# Altium project pca20020.PrjPCB (part 2 of 2)

## Sheet pca20020_sheet7_sound_and_light.SchDoc: PCA20020 - Sound and Light
size A4; DocumentNumber: 7; Revision: 1.0.0; SheetNumber: 7; SheetTotal: 9; DrawnBy: RUBR; PCBRevision: 0264RUBR; DocumentSize: A4; PCAName: PCA20020; PCBNumber: 400182
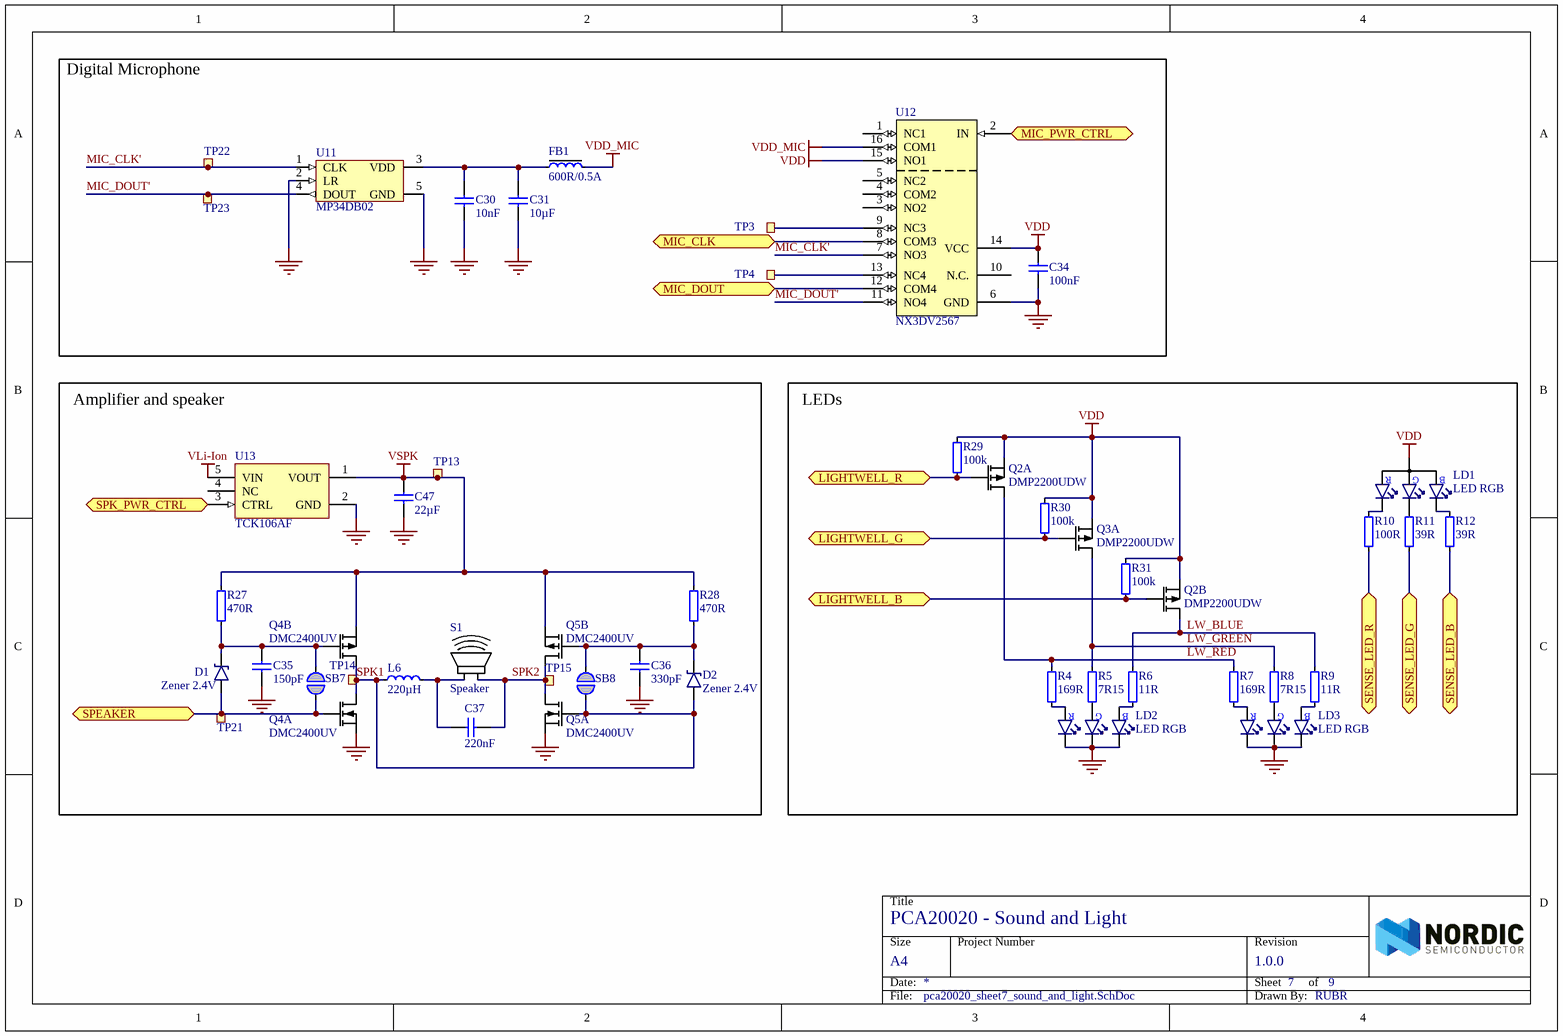
[diagram p6: pca20020_sheet7_sound_and_light.SchDoc]

### Parts
C30  10nF  [CAPC1005X04L]
C31  10µF  [CAPC1608X06L]
C34  100nF  [CAPC1005X04L]
C35  150pF  [CAPC1005X04L]
C36  330pF  [CAPC1005X04L]
C37  220nF  [CAPC1005X04L]
C47  22µF  [CAPC1608X06L]
D1  Zener 2.4V  [SOD-523]
D2  Zener 2.4V  [SOD-523]
FB1  600R/0.5A  [INDC1608X06L]
L6  220µH  [INDP4040X25N]
LD1  LED RGB  [LED_RGB_0606]
LD2  LED RGB  [MSL0104]
LD3  LED RGB  [MSL0104]
Q2  DMP2200UDW  [SOT-363]  (parts A,B of 2)
Q3  DMP2200UDW  [SOT-363]  (part A of 2)
Q4  DMC2400UV  [SOTFL50P162X60-6N]  (parts A,B of 2)
Q5  DMC2400UV  [SOTFL50P162X60-6N]  (parts A,B of 2)
R4  169R  [RESC1005X04L]
R5  7R15  [RESC1005X04L]
R6  11R  [RESC1005X04L]
R7  169R  [RESC1005X04L]
R8  7R15  [RESC1005X04L]
R9  11R  [RESC1005X04L]
R10  100R  [RESC1005X04L]
R11  39R  [RESC1005X04L]
R12  39R  [RESC1005X04L]
R27  470R  [RESC1005X04L]
R28  470R  [RESC1005X04L]
R29  100k  [RESC1005X04L]
R30  100k  [RESC1005X04L]
R31  100k  [RESC1005X04L]
S1  Speaker  [Speaker 15x11x3mm]  (no BOM)
SB7  Solderbridge  [Solderbridge]  (value not drawn)  (no BOM)
SB8  Solderbridge  [Solderbridge]  (value not drawn)  (no BOM)
TP3  TP  [TESTPAD-TH]  (value not drawn)  (no BOM)
TP4  TP  [TESTPAD-TH]  (value not drawn)  (no BOM)
TP13  Ø1.5mm,SMD  [TP_SMD_Ø1.5mm]  (value not drawn)  (no BOM)
TP14  Ø1.5mm,SMD  [TP_SMD_Ø1.5mm]  (value not drawn)  (no BOM)
TP15  Ø1.5mm,SMD  [TP_SMD_Ø1.5mm]  (value not drawn)  (no BOM)
TP21  Ø1.5mm,SMD  [TP_SMD_Ø1.5mm]  (value not drawn)  (no BOM)
TP22  Ø1.5mm,SMD  [TP_SMD_Ø1.5mm]  (value not drawn)  (no BOM)
TP23  Ø1.5mm,SMD  [TP_SMD_Ø1.5mm]  (value not drawn)  (no BOM)
U11  MP34DB02  [RHLGA-4 (3x4x1mm)]
U12  NX3DV2567  [XQFN40P180X260X50-16N]
U13  TCK106AF  [SOT95P280X140-5N]

### Blocks framed on the sheet
Digital Microphone: C30 C31 C34 FB1 TP3 TP4 TP22 TP23 U11 U12
Amplifier and speaker: C35-C37 C47 D1 D2 L6 Q4 Q5 R27 R28 S1 SB7 SB8 TP13-TP15 TP21 U13
LEDs: LD1-LD3 Q2 Q3 R4-R12 R29-R31

### Ports
LIGHTWELL_B (bidir), LIGHTWELL_G (bidir), LIGHTWELL_R (bidir), MIC_CLK (bidir), MIC_DOUT (bidir), MIC_PWR_CTRL (bidir), SENSE_LED_B (bidir), SENSE_LED_G (bidir), SENSE_LED_R (bidir), SPEAKER (bidir), SPK_PWR_CTRL (bidir)

### Nets
GND: C30.1 C31.1 C34.1 C35.1 C36.1 C47.1 LD2.3(C_GREEN) LD2.4(C_RED) LD2.5(C_BLUE) LD3.3(C_GREEN) LD3.4(C_RED) LD3.5(C_BLUE) Q4.1(S1) Q5.1(S1) U11.2(LR) U11.5(GND) U12.6(GND) U13.2(GND)
VDD: C34.2 LD1.4(A) Q2.1(S1) Q2.4(S2) Q3.1(S1) R29.1 R30.1 R31.1 U12.14(VCC) U12.15(NO1)
VDD_MIC: FB1.2 U12.16(COM1)
VLi-Ion: U13.5(VIN)
VSPK: C47.2 Q4.4(S2) Q5.4(S2) R27.1 R28.1 TP13.1 U13.1(VOUT)
LIGHTWELL_B: Q2.5(G2) R31.2 ; port LIGHTWELL_B
LIGHTWELL_G: Q3.2(G1) R30.2 ; port LIGHTWELL_G
LIGHTWELL_R: Q2.2(G1) R29.2 ; port LIGHTWELL_R
LW_BLUE: Q2.3(D2) R6.1 R9.1
LW_GREEN: Q3.6(D1) R5.1 R8.1
LW_RED: Q2.6(D1) R4.1 R7.1
MIC_CLK': TP22.1 U11.1(CLK) U12.7(NO3)
MIC_DOUT': TP23.1 U11.4(DOUT) U12.11(NO4)
MIC_PWR_CTRL: U12.2(IN) ; port MIC_PWR_CTRL
P0.25: U12.12(COM4) ; port MIC_DOUT
P0.26: U12.8(COM3) ; port MIC_CLK
P0.27: D1.1(A) Q4.2(G1) SB7.2 TP21.1 ; port SPEAKER
P0.29: U13.3(CTRL) ; port SPK_PWR_CTRL
SENSE_LED_B: R12.1 ; port SENSE_LED_B
SENSE_LED_G: R11.1 ; port SENSE_LED_G
SENSE_LED_R: R10.1 ; port SENSE_LED_R
SPK1: D2.1(A) L6.1 Q4.3(D2) Q4.6(D1) Q5.2(G1) SB8.2 TP14.1
SPK2: C37.1 Q5.3(D2) Q5.6(D1) S1.2 TP15.1
NetC30_2: C30.2 C31.2 FB1.1 U11.3(VDD)
NetC35_2: C35.2 D1.3(C) Q4.5(G2) R27.2 SB7.1
NetC36_2: C36.2 D2.3(C) Q5.5(G2) R28.2 SB8.1
NetC37_2: C37.2 L6.2 S1.1
NetLD1_1: LD1.1(C_RED) R10.2
NetLD1_2: LD1.2(C_GREEN) R11.2
NetLD1_3: LD1.3(C_BLUE) R12.2
NetLD2_1: LD2.1(A_RED) R4.2
NetLD2_2: LD2.2(A_GREEN) R5.2
NetLD2_6: LD2.6(A_BLUE) R6.2
NetLD3_1: LD3.1(A_RED) R7.2
NetLD3_2: LD3.2(A_GREEN) R8.2
NetLD3_6: LD3.6(A_BLUE) R9.2
NetTP3_1: TP3.1 U12.9(NC3)
NetTP4_1: TP4.1 U12.13(NC4)

Not connected (* = marked no-connect by the designer): U12 1(NC1) 3(NO2) 4(COM2) 5(NC2) 10(N.C.); U13 4(NC)

### Notes on the sheet
- Title
- Size
- Date:
- Project Number
- Sheet         of
- Revision
- File:
- Drawn By:
- (in symbol LTST-C19HE1WT) R; G; B
- (in symbol MSL0104RGBU1) R; G; B

### Library data of the parts
C30 = C0402-10n: Capacitor, X7R, ±10%; Part number IPS: 00000007784; Note: 16V; Artikkelnr Noca: 20039166; Artikkelnr Simpro: N.A.; Part Number: C0402-10n; Manufacturer: *; Manufacturer Part Number: *; Datasheet: *; LatestRevisionDate: 2009-11-23; Pin Count: 2; Publisher: Nordic Semiconductor; Published: 2009-05-08; Value: 10nF; Supplier: *; Supplier part number: *; 2nd source Supplier: *; 2nd source part number: *; Footprint Doc: 0402
C31 = C0603-10µ: Capacitor, X5R, ±20%; Part number IPS: 00000007785; Note: 6.3V; Artikkelnr Noca: 20039234; Artikkelnr Simpro: N.A.; Part Number: C0603-10µ; Manufacturer: *; Manufacturer Part Number: *; Datasheet: *; LatestRevisionDate: 2011-01-17; Pin Count: 2; Publisher: Nordic Semiconductor; Published: 2011-01-17; Value: 10µF; Supplier: *; Supplier part number: *; 2nd source Supplier: *; 2nd source part number: *; Footprint Doc: 0603
C34 = C0402-100n: Capacitor, X7R, ±10%; Part number IPS: 00000005296; Note: 16V; Artikkelnr Noca: 20039200; Artikkelnr Simpro: N.A.; Part Number: C0402-100n; Manufacturer: *; Manufacturer Part Number: *; Datasheet: *; Footprint Doc: 0402; LatestRevisionDate: 2009-11-23; Pin Count: 2; Publisher: Nordic Semiconductor; Published: 2009-05-08; Value: 100nF; Supplier: *; Supplier part number: *; 2nd source Supplier: *; 2nd source part number: *
C35 = C0402-150p: Capacitor, NP0, ±5%; Part number IPS: 00000007972; Note: 50V; Artikkelnr Noca: 20029111; Artikkelnr Simpro: N.A.; Part Number: C0402-150p; Manufacturer: *; Manufacturer Part Number: *; Datasheet: *; Footprint Doc: 0402; LatestRevisionDate: 2009-05-08; Pin Count: 2; Publisher: Nordic Semiconductor; Published: 2009-05-08; Value: 150pF; Supplier: *; Supplier part number: *; 2nd source Supplier: *; 2nd source part number: *
C36 = C0402-330p: Capacitor, NP0, ±5%; Part number IPS: 00000006576; Note: 50V; Artikkelnr Noca: N.A.; Part Number: C0402-330p; Manufacturer: *; Manufacturer Part Number: *; Datasheet: *; Footprint Doc: 0402; LatestRevisionDate: 2017-02-02; Pin Count: 2; Publisher: Nordic Semiconductor; Published: 2009-05-08; Value: 330pF; Supplier: *; Supplier part number: *; 2nd source Supplier: *; 2nd source part number: *; Artikkelnr Simpro: N.A.
C37 = C0402-220n: Capacitor, X7R, ±10%; Part number IPS: 00000006793; Note: 16V; Artikkelnr Noca: N.A.; Part Number: C0402-220n; Manufacturer: *; Manufacturer Part Number: *; Datasheet: *; Footprint Doc: 0402; LatestRevisionDate: 2009-05-08; Pin Count: 2; Publisher: Nordic Semiconductor; Published: 2009-05-08; Value: 220nF; Supplier: *; Supplier part number: *; 2nd source Supplier: *; 2nd source part number: *; Artikkelnr Simpro: N.A.
C47 = C0603-22µ-6.3V: CAP CER 22UF 6.3V 20% X5R 0603; Manufacturer: Samsung; Manufacturer Part Number: CL10A226MQ8NRNC; Part number IPS: 00000007787; Artikkelnr Noca: N.A.; Part Number: C0603-22µ-6.3V; Datasheet: http://www.samsungsem.com/kr/front/downloadcms.do?path=/kr/support/product-search/mlcc/__icsFiles/afieldfile/2014/11/05&fileName=S_CL10A226MQ8NRNC.pdf; Footprint Doc: 0603; LatestRevisionDate: 2015-04-10; Pin Count: 2; Publisher: Nordic Semiconductor; Published: 2015-04-10; Value: 22µF; Note: 6.3V; Supplier: Digi-Key; Supplier part number: 1276-1193-1-ND; 2nd source Supplier: *; 2nd source part number: *; Artikkelnr Simpro: N.A.
D1 D2 = BZT52C2V4T: Diode, Zener, 2.4V, 0.3W; Manufacturer: Diodes Incorporated; Part number IPS: 00000007974; Artikkelnr Noca: N.A.; Part Number: BZT52C2V4T; Manufacturer Part Number: BZT52C2V4T; Datasheet: http://www.diodes.com/_files/datasheets/ds30502.pdf; Footprint Doc: SOD-523; LatestRevisionDate: 2017-01-25; Publisher: Nordic Semiconductor; Published: 2017-01-25; Value: Zener 2.4V; Note: *; Supplier: Digi-Key; Supplier part number: BZT52C2V4T-7DICT-ND; 2nd source Supplier: *; 2nd source part number: *; Artikkelnr Simpro: N.A.; Pin Count: 2
FB1 = FB0603-600R@100MHz-500mA: Ferrite Bead, 600 Ohm @ 100MHz, 500mA, 380 mOhm Max; Manufacturer: Murata; Manufacturer Part Number: BLM18AG601SN1; 2nd source part number: 490-1014-1-ND; Part number IPS: 00000007789; Note: Chip EMIFIL Inductor Type Chip Ferrite Bead; Artikkelnr Noca: 37019100; Artikkelnr Simpro: N.A.; Part Number: FB0603-600R@100MHz-500mA; Datasheet: http://www.farnell.com/datasheets/356366.pdf; Footprint Doc: 0603; LatestRevisionDate: 2014-01-10; Pin Count: 2; Publisher: Nordic Semiconductor; Published: 2010-09-02; Value: 600R/0.5A; Supplier: Farnell; Supplier part number: 151-5679; 2nd source Supplier: Digi-Key; ComponentLink1Description: Datasheet; ComponentLink2Description: Supplier link
L6 = L4040-220µ: Inductor, ±20%, 200mA, 2.76 Ohm; Manufacturer: Bourns; Manufacturer Part Number: SRN4026-221M; Part number IPS: 00000007797; Note: -40°C ~ 125°C; Artikkelnr Noca: N:A; Artikkelnr Simpro: N.A.; Part Number: L4040-220µ; Datasheet: http://www.bourns.com/docs/Product-Datasheets/SRN4026.pdf; Footprint Doc: 4040; LatestRevisionDate: 2016-01-18; Pin Count: 2; Publisher: Nordic Semiconductor; Published: 2016-01-18; Value: 220µH; Supplier: Digi-Key; Supplier part number: SRN4026-221MCT-ND; 2nd source Supplier: *; 2nd source part number: *; ComponentLink1Description: Datasheet; ComponentLink2Description: Supplier link
LD1 = LTST-C19HE1WT: RGB LED 1.60 mm x 1.60 mm SMD; Manufacturer: Lite-On Inc; 2nd source part number: 859-LTST-C19HE1WT; Part number IPS: 00000007798; Artikkelnr Noca: N.A.; Part Number: LTST-C19HE1WT; Manufacturer Part Number: LTST-C19HE1WT; Datasheet: http://optoelectronics.liteon.com/upload/download/DS22-2008-0044/S_110_LTST-C19HE1WT.pdf; LatestRevisionDate: 2016-09-23; Pin Count: 4; Publisher: Nordic Semiconductor; Published: 2016-09-23; Value: LED RGB; Note: *; Supplier: Digi-Key; Supplier part number: 160-2162-1-ND; 2nd source Supplier: Mouser; Footprint Doc: LED_RGB_0606; Artikkelnr Simpro: N.A.
LD2 LD3 = MSL0104RGBU1: High brightness, side view RGB LED; Manufacturer: ROHM; 2nd source part number: 755-MSL0104RGBU1; Part number IPS: 00000007799; Artikkelnr Noca: N.A.; Part Number: MSL0104RGBU1; Manufacturer Part Number: MSL0104RGBU1; Datasheet: http://www.rohm.com/web/eu/datasheet/MSL0104RGBU; LatestRevisionDate: 2016-09-21; Pin Count: 7; Publisher: Nordic Semiconductor; Published: 2016-09-21; Value: LED RGB; Note: *; Supplier: Digi-Key; Supplier part number: MSL0104RGBU1CT-ND; 2nd source Supplier: Mouser; Footprint Doc: 6922; Artikkelnr Simpro: N.A.
Q2 Q3 = DMP2200UDW: Dual P Ch MOFET, 900mA, 260mOhm, 450mW; Manufacturer: Diodes Incorporated; Part number IPS: 00000007802; Note: Dual P Channel Digital FET; Artikkelnr Noca: N.A.; Part Number: DMP2200UDW; Manufacturer Part Number: DMP2200UDW; Datasheet: http://www.diodes.com/_files/datasheets/DMP2200UDW.pdf; Footprint Doc: SOT-363; LatestRevisionDate: 2016-11-08; Pin Count: 6; Publisher: Nordic Semiconductor; Published: 2016-11-08; Value: DMP2200UDW; Supplier: Digi-Key; Supplier part number: DMP2200UDW-7DICT-ND; 2nd source Supplier: *; 2nd source part number: *; Artikkelnr Simpro: N.A.
Q4 Q5 = DMC2400UV: Dual N & P Ch MOFET, 1.03A/0.7A, 480mOhm, 450mW; Manufacturer: Diodes Incorporated; Part number IPS: 00000007803; Note: Dual N & P Channel Digital FET; Artikkelnr Noca: N.A.; Part Number: DMC2400UV; Manufacturer Part Number: DMC2400UV; Datasheet: http://www.diodes.com/_files/datasheets/DMC2400UV.pdf; Footprint Doc: SOT-563; LatestRevisionDate: 2016-01-18; Pin Count: 6; Publisher: Nordic Semiconductor; Published: 2016-01-18; Value: DMC2400UV; Supplier: Digi-Key; Supplier part number: DMC2400UV-7DICT-ND; 2nd source Supplier: *; 2nd source part number: *; Artikkelnr Simpro: N.A.
R4 R7 = R0402-169: Resistor, ±1%, 0.063W; Part number IPS: 00000007805; Note: Chip Res 1%; Artikkelnr Noca: N.A.; Value Ohm: 169; Part Number: R0402-169; Manufacturer: *; Manufacturer Part Number: *; Datasheet: *; LatestRevisionDate: 2016-09-22; Pin Count: 2; Publisher: Nordic Semiconductor; Published: 2016-09-22; Value: 169R; Supplier: Digi-Key; Supplier part number: 541-169LCT-ND; 2nd source Supplier: *; 2nd source part number: *; Footprint Doc: 0402; Artikkelnr Simpro: N.A.
R5 R8 = R0402-7R15: Resistor, ±1%, 0.063W; Part number IPS: 00000007806; Note: Chip Res 1%; Artikkelnr Noca: N.A.; Value Ohm: 7.15; Part Number: R0402-7R15; Manufacturer: *; Manufacturer Part Number: *; Datasheet: *; LatestRevisionDate: 2016-09-22; Pin Count: 2; Publisher: Nordic Semiconductor; Published: 2016-09-22; Value: 7R15; Supplier: Digi-Key; Supplier part number: 541-7.15LLCT-ND; 2nd source Supplier: *; 2nd source part number: *; Footprint Doc: 0402; Artikkelnr Simpro: N.A.
R6 R9 = R0402-11R: Resistor, ±1%, 0.063W; Part number IPS: 00000007807; Note: Chip Res 1%; Artikkelnr Noca: N.A.; Value Ohm: 11; Part Number: R0402-11R; Manufacturer: *; Manufacturer Part Number: *; Datasheet: *; LatestRevisionDate: 2016-11-09; Pin Count: 2; Publisher: Nordic Semiconductor; Published: 2016-11-09; Value: 11R; Supplier: Farnell; Supplier part number: 214-0577; 2nd source Supplier: *; 2nd source part number: *; Footprint Doc: 0402; Artikkelnr Simpro: N.A.
R10 = R0402-100: Resistor, ±1%, 0.063W; Part number IPS: 00000002811; Note: Chip Res 1%; Artikkelnr Noca: 27049049; Artikkelnr Simpro: N.A.; Value Ohm: 100; Part Number: R0402-100; Manufacturer: *; Manufacturer Part Number: *; Datasheet: *; LatestRevisionDate: 2009-11-23; Pin Count: 2; Publisher: Nordic Semiconductor; Published: 2009-05-08; Value: 100R; Supplier: Farnell; Supplier part number: 173-8837; 2nd source Supplier: *; 2nd source part number: *; Footprint Doc: 0402
R11 R12 = R0402-39R: Resistor, ±1%, 0.063W; Part number IPS: 00000000821; Note: Chip Res 1%; Artikkelnr Noca: 27049039; Artikkelnr Simpro: N.A.; Value Ohm: 39; Part Number: R0402-39R; Manufacturer: *; Manufacturer Part Number: *; Datasheet: *; LatestRevisionDate: 2009-11-23; Pin Count: 2; Publisher: Nordic Semiconductor; Published: 2009-05-08; Value: 39R; Supplier: Farnell; Supplier part number: 173-8831; 2nd source Supplier: *; 2nd source part number: *; Footprint Doc: 0402
R27 R28 = R0402-470: Resistor, ±1%, 0.063W; Part number IPS: 00000007975; Note: Chip Res 1%; Artikkelnr Noca: 27049065; Artikkelnr Simpro: N.A.; Value Ohm: 470; Part Number: R0402-470; Manufacturer: *; Manufacturer Part Number: *; Datasheet: *; LatestRevisionDate: 2009-11-23; Pin Count: 2; Publisher: Nordic Semiconductor; Published: 2009-05-08; Value: 470R; Supplier: Farnell; Supplier part number: 173-8845; 2nd source Supplier: *; 2nd source part number: *; Footprint Doc: 0402
R29-R31 = R0402-100k: Resistor, ±1%, 0.063W; Part number IPS: 00000003667; Note: Chip Res 1%; Artikkelnr Noca: 27049121; Artikkelnr Simpro: N.A.; Value Ohm: 100000; Part Number: R0402-100k; Manufacturer: *; Manufacturer Part Number: *; Datasheet: *; LatestRevisionDate: 2009-11-23; Pin Count: 2; Publisher: Nordic Semiconductor; Published: 2009-05-08; Value: 100k; Supplier: Farnell; Supplier part number: 173-8877; 2nd source Supplier: *; 2nd source part number: *; Footprint Doc: 0402
S1 = BMS1511F-11C-08H03P LF: Speaker, SMD, 15.0mm x 11.0mm x 3.0mm, 0Hz-20kHz, 89dB, 8 ohm, 0.7W; Manufacturer: BeStar; Artikkelnr Noca: N.A.; Part Number: BMS1511F-11C-08H03P LF; Manufacturer Part Number: BMS1511F-11C-08H03P LF; Datasheet: \\hizz\pro\app9717\Datasheet\speakers\bestar\BMS1511F-11C-08H03P LF.pdf; Footprint Doc: Speaker 15x11x3mm; LatestRevisionDate: 2016-09-15; Pin Count: 2; Publisher: Nordic Semiconductor; Published: 2016-09-15; Value: Speaker; Note: *; Supplier: *; Supplier part number: *; 2nd source Supplier: *; 2nd source part number: *; Artikkelnr Simpro: N.A.
SB7 SB8 = Solderbridge: Artikkelnr Noca: N.A.; Part Number: Solderbridge; Manufacturer: *; Manufacturer Part Number: *; Datasheet: *; Footprint Doc: Solderbridge; LatestRevisionDate: 2009-12-14; Pin Count: 2; Publisher: Nordic Semiconductor; Published: 2009-12-14; Value: Solderbridge; Note: *; Supplier: *; Supplier part number: *; 2nd source Supplier: *; 2nd source part number: *; Artikkelnr Simpro: N.A.
TP3 TP4 = Testpoint TH: Testpoint, through hole; Artikkelnr Noca: N.A.; Part Number: Testpoint TH; Manufacturer: *; Manufacturer Part Number: *; Datasheet: *; Footprint Doc: TESTPAD-TH; LatestRevisionDate: 2009-12-12; Pin Count: 1; Publisher: Nordic Semiconductor; Published: 2009-12-12; Value: TP; Note: *; Supplier: *; Supplier part number: *; 2nd source Supplier: *; 2nd source part number: *; Artikkelnr Simpro: N.A.
TP13-TP15 TP21-TP23 = TP_SMD_Ø1.5MM: 1.0mm circular SMD testpad; Manufacturer: Nordic Semiconductor; Artikkelnr Noca: N.A.; Part Number: TP_SMD_Ø1.5MM; Manufacturer Part Number: *; Datasheet: *; Footprint Doc: TP_SMD_Ø1.5mm; LatestRevisionDate: 2016-06-02; Pin Count: 1; Publisher: Nordic Semiconductor; Published: 2016-06-02; Value: Ø1.5mm,SMD; Note: *; Supplier: *; Supplier part number: *; 2nd source Supplier: *; 2nd source part number: *; Artikkelnr Simpro: N.A.
U11 = MP34DB02: MEMS audio sensor omnidirectional digital microphone; Manufacturer: STMicroelectronics; 2nd source part number: 511-MP34DB02TR; Part number IPS: 00000007822; Note: Alternative: ADMP421, SPK0833LM4H-B, MP34DB01; Artikkelnr Noca: N.A.; Part Number: MP34DB02; Manufacturer Part Number: MP34DB02; Datasheet: http://www.st.com/web/en/resource/technical/document/datasheet/DM00111225.pdf; LatestRevisionDate: 2015-11-11; Pin Count: 5; Publisher: Nordic Semiconductor; Published: 2015-11-11; Value: MP34DB02; Supplier: Digi-Key; Supplier part number: 497-15103-1-ND; 2nd source Supplier: Mouser; Footprint Doc: RHLGA-4; Artikkelnr Simpro: N.A.
U12 = NX3DV2567GU: Low-ohmic four-pole double-throw analog switch; Manufacturer: NXP Semiconductors; 2nd source part number: 771-NX3DV2567GU115; Part number IPS: 00000007816; Artikkelnr Noca: 15079317; Artikkelnr Simpro: N.A.; Part Number: NX3DV2567GU; Manufacturer Part Number: NX3DV2567GU; Datasheet: http://www.nxp.com/documents/data_sheet/NX3DV2567.pdf; Footprint Doc: XQFN-16; LatestRevisionDate: 2015-02-17; Pin Count: 16; Publisher: Nordic Semiconductor; Published: 2015-02-17; Value: NX3DV2567; Note: *; Supplier: Digi-Key; Supplier part number: 568-5206-1-ND; 2nd source Supplier: Mouser
U13 = TCK106AF,LF: 1.0 A Load Switch IC with Slew Rate Control Driver in Small Package; Manufacturer: Toshiba; Part number IPS: 00000007823; Artikkelnr Noca: 15070086; Artikkelnr Simpro: N.A.; Part Number: TCK106AF,LF; Manufacturer Part Number: TCK106AF,LF; Datasheet: https://toshiba.semicon-storage.com/info/docget.jsp?did=53240&prodName=TCK108AF; Footprint Doc: SOT-25; LatestRevisionDate: 2016-09-29; Pin Count: 5; Publisher: Nordic Semiconductor; Published: 2016-09-29; Value: TCK106AF; Note: *; Supplier: Digi-Key; Supplier part number: TCK106AFLFCT-ND; 2nd source Supplier: *; 2nd source part number: *

## Sheet pca20020_sheet8_power_supply.SchDoc: PCA20020 - Power Supply
size A4; DocumentNumber: 8; Revision: 1.0.0; SheetNumber: 8; SheetTotal: 9; DrawnBy: RUBR; PCBRevision: 0264RUBR; DocumentSize: A4; PCAName: PCA20020; PCBNumber: 400182
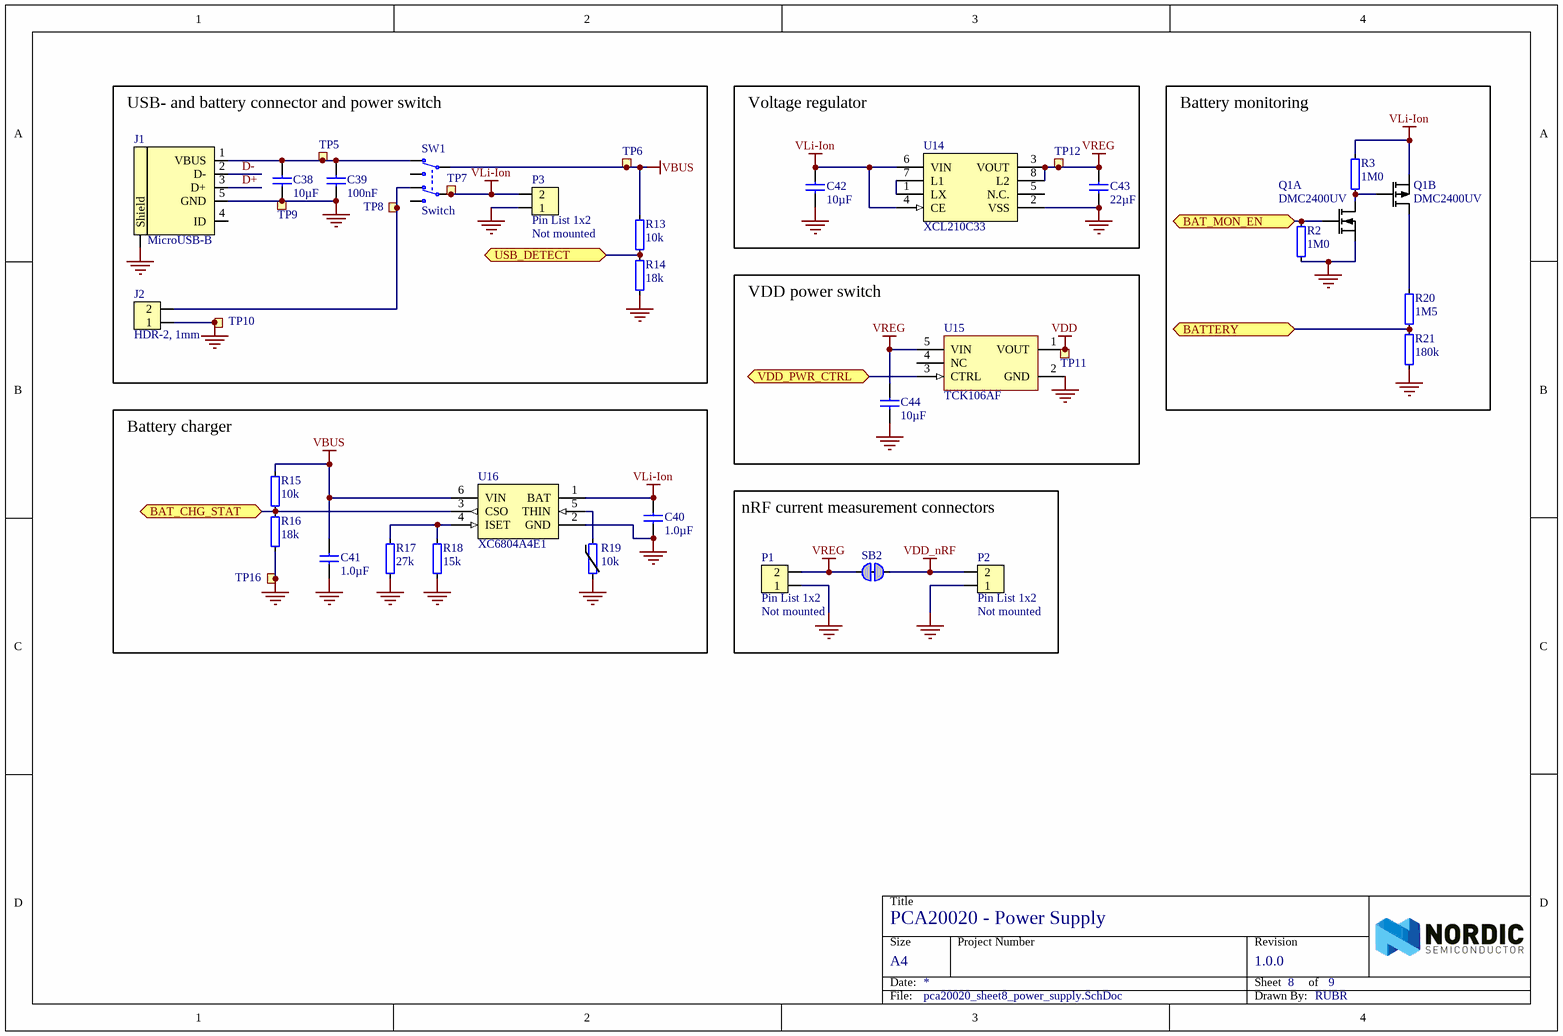
[diagram p7: pca20020_sheet8_power_supply.SchDoc]

### Parts
C38  10µF  [CAPC1608X06L]
C39  100nF  [CAPC1005X04L]
C40  1.0µF  [CAPC1608X06L]
C41  1.0µF  [CAPC1608X06L]
C42  10µF  [CAPC1608X06L]
C43  22µF  [CAPC1608X06L]
C44  10µF  [CAPC1608X06L]
J1  MicroUSB-B  [USB-Micro-B-RA-SMD-PiP]
J2  HDR-2, 1mm  [SM02B-SRSS-TB]
P1  Pin List 1x2  Assembly: Not mounted  [LIST_1x2-NC]
P2  Pin List 1x2  Assembly: Not mounted  [LIST_1x2-NC]
P3  Pin List 1x2  Assembly: Not mounted  [LIST_1x2-NC]
Q1  DMC2400UV  [SOTFL50P162X60-6N]  (parts A,B of 2)
R2  1M0  [RESC1005X04L]
R3  1M0  [RESC1005X04L]
R13  10k  [RESC1005X04L]
R14  18k  [RESC1005X04L]
R15  10k  [RESC1005X04L]
R16  18k  [RESC1005X04L]
R17  27k  [RESC1005X04L]
R18  15k  [RESC1005X04L]
R19  10k  [RESC1005X04L]
R20  1M5  [RESC1005X04L]
R21  180k  [RESC1005X04L]
SB2  Solderbridge  [Solderbridge_Shorted]  (value not drawn)  (net tie, no BOM)
SW1  Switch  [Switch-Slide-RA-J-Lead-DPDT-8.5x3.5mm]
TP5  Ø1.5mm,SMD  [TP_SMD_Ø1.5mm]  (value not drawn)  (no BOM)
TP6  Ø1.5mm,SMD  [TP_SMD_Ø1.5mm]  (value not drawn)  (no BOM)
TP7  Ø1.5mm,SMD  [TP_SMD_Ø1.5mm]  (value not drawn)  (no BOM)
TP8  Ø1.5mm,SMD  [TP_SMD_Ø1.5mm]  (value not drawn)  (no BOM)
TP9  Ø1.5mm,SMD  [TP_SMD_Ø1.5mm]  (value not drawn)  (no BOM)
TP10  Ø1.5mm,SMD  [TP_SMD_Ø1.5mm]  (value not drawn)  (no BOM)
TP11  Ø1.5mm,SMD  [TP_SMD_Ø1.5mm]  (value not drawn)  (no BOM)
TP12  Ø1.5mm,SMD  [TP_SMD_Ø1.5mm]  (value not drawn)  (no BOM)
TP16  TP  [TESTPAD-TH]  (value not drawn)  (no BOM)
U14  XCL210C33  [CL-2025]
U15  TCK106AF  [SOT95P280X140-5N]
U16  XC6804A4E1  [USP-6EL]

### Blocks framed on the sheet
USB- and battery connector and power switch: C38 C39 J1 J2 P3 R13 R14 SW1 TP5-TP10
Voltage regulator: C42 C43 TP12 U14
Battery monitoring: Q1 R2 R3 R20 R21
VDD power switch: C44 TP11 U15
Battery charger: C40 C41 R15-R19 TP16 U16
nRF current measurement connectors: P1 P2 SB2

### Ports
BAT_CHG_STAT (bidir), BAT_MON_EN (bidir), BATTERY (bidir), USB_DETECT (bidir), VDD_PWR_CTRL (bidir)

### Nets
GND: C38.2 C39.2 C40.1 C41.1 C42.1 C43.1 C44.1 J1.5(GND) J1.6(Shield) J2.1 P1.1 P2.1 P3.1 Q1.1(S1) R2.2 R14.2 R16.2 R17.2 R18.2 R19.2 R21.2 TP9.1 TP10.1 TP16.1 U14.2(VSS) U14.9(VSS) U15.2(GND) U16.2(GND) U16.7(GND)
VBUS: C41.2 R13.1 R15.1 SW1.2(COM-1) TP6.1 U16.6(VIN)
VDD: TP11.1 U15.1(VOUT)
VDD_nRF: P2.2 SB2.1
VLi-Ion: C40.2 C42.2 P3.2 Q1.4(S2) R3.1 SW1.5(COM-2) TP7.1 U14.4(CE) U14.6(VIN) U16.1(BAT)
VREG: C43.2 C44.2 P1.2 SB2.2 TP12.1 U14.3(VOUT) U14.8(L2) U15.5(VIN)
BAT_MON_EN: Q1.2(G1) R2.1 ; port BAT_MON_EN
D+: J1.3(D+)
D-: J1.2(D-)
P0.13: R13.2 R14.1 ; port USB_DETECT
P0.17: R15.2 R16.1 U16.3(CSO) ; port BAT_CHG_STAT
P0.28: R20.2 R21.1 ; port BATTERY
P0.30: U15.3(CTRL) ; port VDD_PWR_CTRL
NetC38_1: C38.1 C39.1 J1.1(VBUS) SW1.3(N.C-1) TP5.1
NetJ2_2: J2.2 SW1.6(N.C-2) TP8.1
NetQ1_3: Q1.3(D2) R20.1
NetQ1_5: Q1.5(G2) Q1.6(D1) R3.2
NetR17_1: R17.1 R18.1 U16.4(ISET)
NetR19_1: R19.1 U16.5(THIN)
NetU14_1: U14.1(LX) U14.7(L1)

Not connected (* = marked no-connect by the designer): J1 4(ID); SW1 1(N.O-1) 4(N.O-2); U14 5(N.C.); U15 4(NC)

### Notes on the sheet
- Title
- Size
- Date:
- Project Number
- Sheet         of
- Revision
- File:
- Drawn By:

### Library data of the parts
C38 C42 C44 = C0603-10µ: as C31 on sheet pca20020_sheet7_sound_and_light; Part Number: C0603-10µ; Manufacturer: *; Manufacturer Part Number: *; Datasheet: *; LatestRevisionDate: 2011-01-17; Pin Count: 2; Publisher: Nordic Semiconductor; Published: 2011-01-17; Value: 10µF; Supplier: *; Supplier part number: *; 2nd source Supplier: *; 2nd source part number: *; Footprint Doc: 0603
C39 = C0402-100n: as C34 on sheet pca20020_sheet7_sound_and_light; Part Number: C0402-100n; Manufacturer: *; Manufacturer Part Number: *; Datasheet: *; LatestRevisionDate: 2009-11-23; Pin Count: 2; Publisher: Nordic Semiconductor; Published: 2009-05-08; Value: 100nF; Supplier: *; Supplier part number: *; 2nd source Supplier: *; 2nd source part number: *; Footprint Doc: 0402
C40 C41 = C0603-1µ0: Capacitor, X7R, ±10%; Part number IPS: 00000000616; Note: 16V; Artikkelnr Noca: 20039335; Artikkelnr Simpro: N.A.; Part Number: C0603-1µ0; Manufacturer: *; Manufacturer Part Number: *; Datasheet: *; Footprint Doc: 0603; LatestRevisionDate: 2013-06-05; Pin Count: 2; Publisher: Nordic Semiconductor; Published: 2009-05-08; Value: 1.0µF; Supplier: *; Supplier part number: *; 2nd source Supplier: *; 2nd source part number: *
C43 = C0603-22µ-6.3V: as C47 on sheet pca20020_sheet7_sound_and_light; Part Number: C0603-22µ-6.3V; Datasheet: http://www.samsungsem.com/kr/front/downloadcms.do?path=/kr/support/product-search/mlcc/__icsFiles/afieldfile/2014/11/05&fileName=S_CL10A226MQ8NRNC.pdf; Footprint Doc: 0603; LatestRevisionDate: 2015-04-10; Pin Count: 2; Publisher: Nordic Semiconductor; Published: 2015-04-10; Value: 22µF; Note: 6.3V; Supplier: Digi-Key; Supplier part number: 1276-1193-1-ND; 2nd source Supplier: *; 2nd source part number: *; Artikkelnr Simpro: N.A.
J1 = USB-Micro-B-RA-SMD-PiP: MicroUSB-B-SMT; Manufacturer: Allen Creations Corp.; Manufacturer Part Number: AJU55-BS2111-L; 2nd source part number: 609-4616-1-ND; Part number IPS: 00000007790; Artikkelnr Noca: 55029020; Artikkelnr Simpro: N.A.; Part Number: USB-Micro-B-RA-SMD-PiP; Datasheet: \\hizz\pro\app9717\Datasheet\connectores\Allen Creations Corp\AJU-211.pdf; Footprint Doc: USB-Micro-B-RA-SMD-PiP; LatestRevisionDate: 2016-04-21; Pin Count: 5; Publisher: Nordic Semiconductor; Published: 2014-10-07; Value: MicroUSB-B; Note: *; Supplier: Cabcon; Supplier part number: AJU55-BS2111-L; 2nd source Supplier: Digi-Key
J2 = SM02B-SRSS-TB: 1.0mm pitch connector side entry SMD; Manufacturer: JST; Manufacturer Part Number: SM02B-SRSS-TB(LF)(SN); Part number IPS: 00000007791; Note: JST, Header; Artikkelnr Noca: 55010030; Artikkelnr Simpro: N.A.; Part Number: SM02B-SRSS-TB; Datasheet: http://www.jst-mfg.com/product/pdf/eng/eSH.pdf; Footprint Doc: SM02B-SRSS-TB; LatestRevisionDate: 2016-06-20; Pin Count: 2; Publisher: Nordic Semiconductor; Published: 2016-06-20; Value: HDR-2, 1mm; Supplier: Digi-Key; Supplier part number: 455-1802-1-ND; 2nd source Supplier: *; 2nd source part number: *
P1-P3 = Pin List 1x2, N.C.: Pin List 1x2, 2.54mm (100mil); Artikkelnr Noca: N.A.; Part Number: Pin List 1x2, N.C.; Manufacturer: *; Manufacturer Part Number: *; Datasheet: *; Footprint Doc: LIST_1x2; LatestRevisionDate: 2017-02-02; Pin Count: 2; Publisher: Nordic Semiconductor; Published: 2017-01-30; Value: Pin List 1x2; Note: *; Supplier: *; Supplier part number: *; 2nd source Supplier: *; 2nd source part number: *; Artikkelnr Simpro: N.A.
Q1 = DMC2400UV: as Q4 on sheet pca20020_sheet7_sound_and_light; Part Number: DMC2400UV; Manufacturer Part Number: DMC2400UV; Datasheet: http://www.diodes.com/_files/datasheets/DMC2400UV.pdf; Footprint Doc: SOT-563; LatestRevisionDate: 2016-01-18; Pin Count: 6; Publisher: Nordic Semiconductor; Published: 2016-01-18; Value: DMC2400UV; Supplier: Digi-Key; Supplier part number: DMC2400UV-7DICT-ND; 2nd source Supplier: *; 2nd source part number: *; Artikkelnr Simpro: N.A.
R2 R3 = R0402-1M0: Resistor, ±1%, 0.063W; Part number IPS: 00000006807; Note: Chip Res 1%; Artikkelnr Noca: 27049145; Artikkelnr Simpro: N.A.; Value Ohm: 1000000; Part Number: R0402-1M0; Manufacturer: *; Manufacturer Part Number: *; Datasheet: *; LatestRevisionDate: 2009-11-23; Pin Count: 2; Publisher: Nordic Semiconductor; Published: 2009-05-08; Value: 1M0; Supplier: *; Supplier part number: *; 2nd source Supplier: *; 2nd source part number: *; Footprint Doc: 0402
R13 R15 = R0402-10k: Resistor, ±1%, 0.063W; Part number IPS: 00000002093; Note: Chip Res 1%; Artikkelnr Noca: 27049097; Artikkelnr Simpro: N.A.; Value Ohm: 10000; Part Number: R0402-10k; Manufacturer: *; Manufacturer Part Number: *; Datasheet: *; LatestRevisionDate: 2009-11-23; Pin Count: 2; Publisher: Nordic Semiconductor; Published: 2009-05-08; Value: 10k; Supplier: Farnell; Supplier part number: 173-8864; 2nd source Supplier: *; 2nd source part number: *; Footprint Doc: 0402
R14 R16 = R0402-18k: Resistor, ±1%, 0.063W; Part number IPS: 00000003300; Note: Chip Res 1%; Artikkelnr Noca: 27049103; Artikkelnr Simpro: N.A.; Value Ohm: 18000; Part Number: R0402-18k; Manufacturer: *; Manufacturer Part Number: *; Datasheet: *; LatestRevisionDate: 2009-11-23; Pin Count: 2; Publisher: Nordic Semiconductor; Published: 2009-05-08; Value: 18k; Supplier: Farnell; Supplier part number: 173-8867; 2nd source Supplier: *; 2nd source part number: *; Footprint Doc: 0402
R17 = R0402-27k: Resistor, ±1%, 0.063W; Part number IPS: 00000004188; Note: Chip Res 1%; Artikkelnr Noca: 27049107; Artikkelnr Simpro: N.A.; Value Ohm: 27000; Part Number: R0402-27k; Manufacturer: *; Manufacturer Part Number: *; Datasheet: *; LatestRevisionDate: 2009-11-23; Pin Count: 2; Publisher: Nordic Semiconductor; Published: 2009-05-08; Value: 27k; Supplier: Farnell; Supplier part number: 173-8869; 2nd source Supplier: *; 2nd source part number: *; Footprint Doc: 0402
R18 = R0402-15k: Resistor, ±1%, 0.063W; Part number IPS: 00000002098; Note: Chip Res 1%; Artikkelnr Noca: 27049101; Artikkelnr Simpro: N.A.; Value Ohm: 15000; Part Number: R0402-15k; Manufacturer: *; Manufacturer Part Number: *; Datasheet: *; LatestRevisionDate: 2009-11-23; Pin Count: 2; Publisher: Nordic Semiconductor; Published: 2009-05-08; Value: 15k; Supplier: Farnell; Supplier part number: 173-8866; 2nd source Supplier: *; 2nd source part number: *; Footprint Doc: 0402
R19 = NCP15XH103F03RC: THERMISTOR 10K OHM NTC 0402 SMD; Manufacturer: Murata; 2nd source part number: 2456121; Part number IPS: 00000007808; Note: Chip Res 1%; Artikkelnr Noca: N.A.; Value Ohm: 10000; Part Number: NCP15XH103F03RC; Manufacturer Part Number: NCP15XH103F03RC; Datasheet: *; LatestRevisionDate: 2015-03-25; Pin Count: 2; Publisher: Nordic Semiconductor; Published: 2015-03-25; Value: 10k; Supplier: Digi-Key; Supplier part number: 490-4801-1-ND; 2nd source Supplier: Farnell; Footprint Doc: 0402; Artikkelnr Simpro: N.A.
R20 = R0402-1M5: Resistor, ±1%, 0.063W; Part number IPS: 00000007809; Note: Chip Res 1%; Artikkelnr Noca: 27049149; Artikkelnr Simpro: N.A.; Value Ohm: 1500000; Part Number: R0402-1M5; Manufacturer: *; Manufacturer Part Number: *; Datasheet: *; LatestRevisionDate: 2009-11-23; Pin Count: 2; Publisher: Nordic Semiconductor; Published: 2009-05-08; Value: 1M5; Supplier: *; Supplier part number: *; 2nd source Supplier: *; 2nd source part number: *; Footprint Doc: 0402
R21 = R0402-180k: Resistor, ±1%, 0.063W; Part number IPS: 00000007810; Note: Chip Res 1%; Artikkelnr Noca: 27049127; Artikkelnr Simpro: N.A.; Value Ohm: 180000; Part Number: R0402-180k; Manufacturer: *; Manufacturer Part Number: *; Datasheet: *; LatestRevisionDate: 2009-11-23; Pin Count: 2; Publisher: Nordic Semiconductor; Published: 2009-05-08; Value: 180k; Supplier: *; Supplier part number: *; 2nd source Supplier: *; 2nd source part number: *; Footprint Doc: 0402
SB2 = Solderbridge Shorted: Shorted Solderbridge; Artikkelnr Noca: N.A.; Part Number: Solderbridge Shorted; Manufacturer: *; Manufacturer Part Number: *; Datasheet: *; Footprint Doc: Solderbridge_Shorted; LatestRevisionDate: 2012-08-07; Pin Count: 2; Publisher: Nordic Semiconductor; Published: 2012-08-07; Value: Solderbridge; Note: *; Supplier: *; Supplier part number: *; 2nd source Supplier: *; 2nd source part number: *; Artikkelnr Simpro: N.A.
SW1 = Switch-Slide-RA-J-Lead-DPDT-8.5x3.5mm_C&K: SMD slide Switch (ON-ON); Manufacturer: C&K Components; Manufacturer Part Number: JS202011JAQN; 2nd source part number: 611-JS202011JAQN; Part number IPS: 00000007811; Artikkelnr Noca: N.A.; Part Number: Switch-Slide-RA-J-Lead-DPDT-8.5x3.5mm_C&K; Datasheet: http://www.ck-components.com/media/1422/js.pdf; Footprint Doc: Switch-Slide-RA-J-Lead-DPDT-8.5x3.5mm; LatestRevisionDate: 2017-02-01; Pin Count: 6; Publisher: Nordic Semiconductor; Published: 2016-09-15; Value: Switch; Note: *; Supplier: Digi-Key; Supplier part number: CKN10722CT-ND; 2nd source Supplier: Mouser; Artikkelnr Simpro: N.A.
TP5-TP12 = TP_SMD_Ø1.5MM: as TP13 on sheet pca20020_sheet7_sound_and_light; Part Number: TP_SMD_Ø1.5MM; Manufacturer Part Number: *; Datasheet: *; Footprint Doc: TP_SMD_Ø1.5mm; LatestRevisionDate: 2016-06-02; Pin Count: 1; Publisher: Nordic Semiconductor; Published: 2016-06-02; Value: Ø1.5mm,SMD; Note: *; Supplier: *; Supplier part number: *; 2nd source Supplier: *; 2nd source part number: *; Artikkelnr Simpro: N.A.
TP16 = Testpoint TH: as TP3 on sheet pca20020_sheet7_sound_and_light; Part Number: Testpoint TH; Manufacturer: *; Manufacturer Part Number: *; Datasheet: *; Footprint Doc: TESTPAD-TH; LatestRevisionDate: 2009-12-12; Pin Count: 1; Publisher: Nordic Semiconductor; Published: 2009-12-12; Value: TP; Note: *; Supplier: *; Supplier part number: *; 2nd source Supplier: *; 2nd source part number: *; Artikkelnr Simpro: N.A.
U14 = XCL210C33: 3.3V 200mA Inductor Built-in Step-Down “micro DC/DC” Converter; Manufacturer: Torex Semiconductor; Part number IPS: 00000007826; Artikkelnr Noca: N.A.; Part Number: XCL210C33; Manufacturer Part Number: XCL210C33; Datasheet: https://www.torexsemi.com/file/xcl210/XCL210.pdf; Footprint Doc: CL-2025; LatestRevisionDate: 2017-01-30; Pin Count: 8; Publisher: Nordic Semiconductor; Published: 2016-09-29; Value: XCL210C33; Note: *; Supplier: *; Supplier part number: *; 2nd source Supplier: *; 2nd source part number: *; Artikkelnr Simpro: N.A.
U15 = TCK106AF,LF: as U13 on sheet pca20020_sheet7_sound_and_light; Part Number: TCK106AF,LF; Manufacturer Part Number: TCK106AF,LF; Datasheet: https://toshiba.semicon-storage.com/info/docget.jsp?did=53240&prodName=TCK108AF; Footprint Doc: SOT-25; LatestRevisionDate: 2016-09-29; Pin Count: 5; Publisher: Nordic Semiconductor; Published: 2016-09-29; Value: TCK106AF; Note: *; Supplier: Digi-Key; Supplier part number: TCK106AFLFCT-ND; 2nd source Supplier: *; 2nd source part number: *
U16 = XC6804A4E14R-G: One Cell Li-ion/Li-polymer Linear Charger IC with Battery Temperature Detection; Manufacturer: Torex Semiconductor; 2nd source part number: 865-XC6804A4E14R-G; Part number IPS: 00000007825; Artikkelnr Noca: N.A.; Part Number: XC6804A4E14R-G; Manufacturer Part Number: XC6804A4E14R-G; Datasheet: https://www.torexsemi.com/file/xc6804/XC6804.pdf; Footprint Doc: USP-6EL; LatestRevisionDate: 2016-09-29; Pin Count: 6; Publisher: Nordic Semiconductor; Published: 2016-09-29; Value: XC6804A4E1; Note: *; Supplier: Digi-Key; Supplier part number: 893-1312-1-ND; 2nd source Supplier: Mouser; Artikkelnr Simpro: N.A.

## Sheet pca20020_sheet9_interface.SchDoc: PCA20020 - Interface
size A4; DocumentNumber: 9; Revision: 1.0.0; SheetNumber: 9; SheetTotal: 9; DrawnBy: RUBR; PCBRevision: 0264RUBR; DocumentSize: A4; PCAName: PCA20020; PCBNumber: 400182
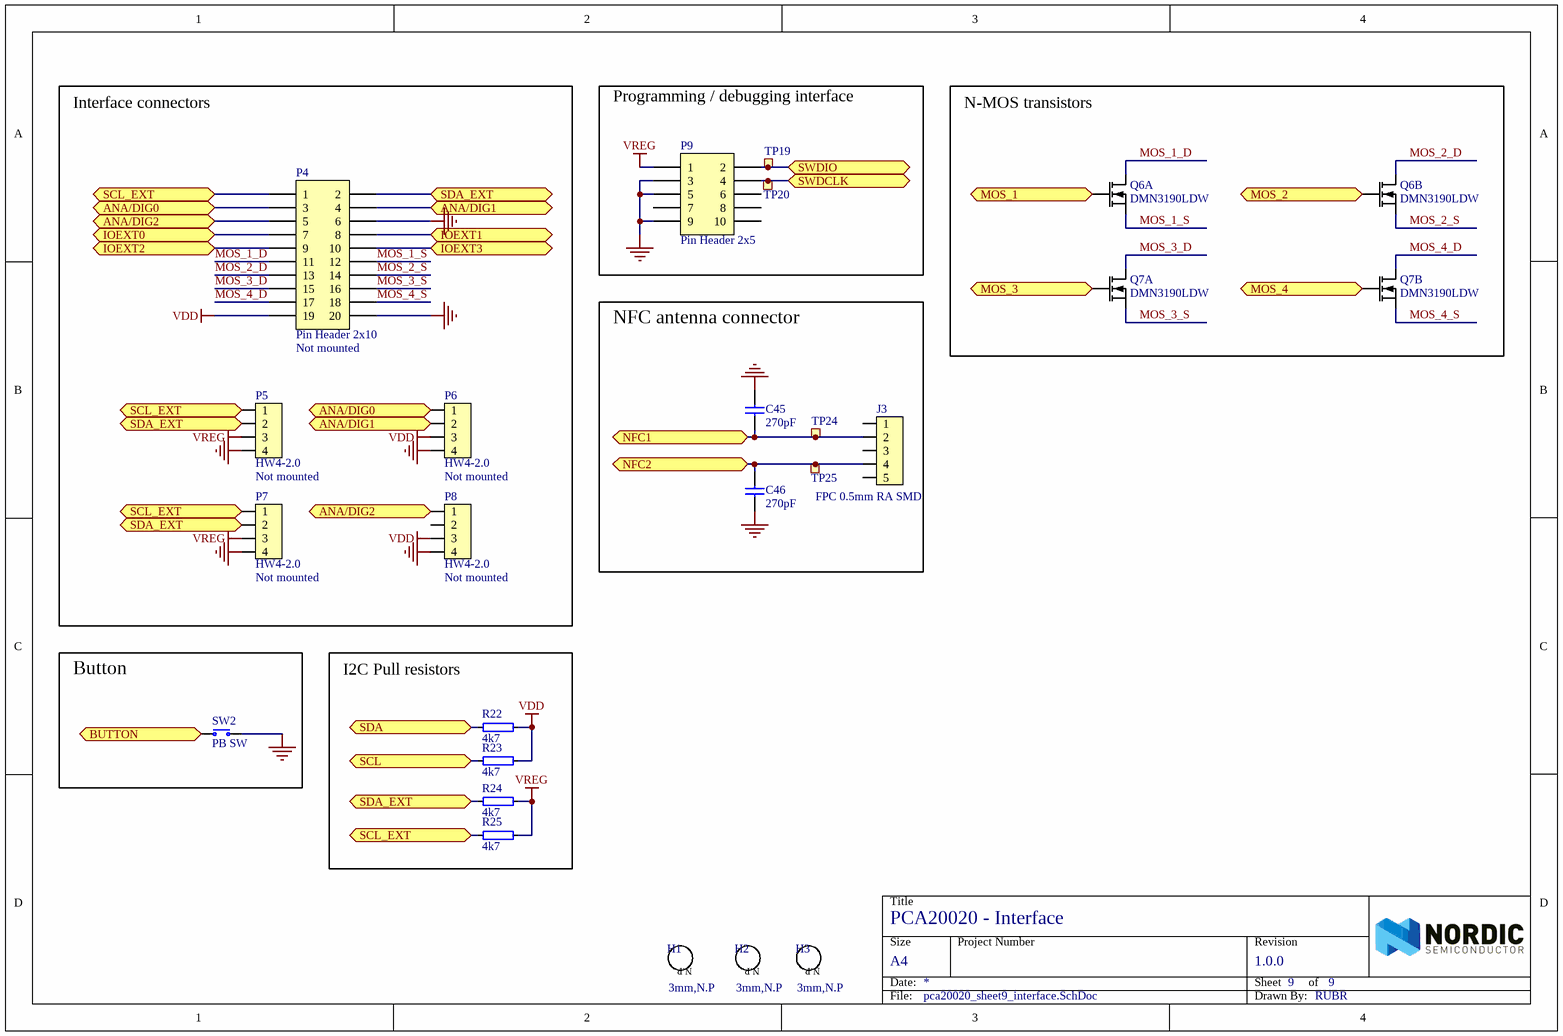
[diagram p8: pca20020_sheet9_interface.SchDoc]

### Parts
C45  270pF  [CAPC1005X04L]
C46  270pF  [CAPC1005X04L]
H1  3mm,N.P  [HOLE_NP_3MM]  (no BOM)
H2  3mm,N.P  [HOLE_NP_3MM]  (no BOM)
H3  3mm,N.P  [HOLE_NP_3MM]  (no BOM)
J3  FPC 0.5mm RA SMD  [FPC_05P-0.5mm-RA-SMD]
P4  Pin Header 2x10  Assembly: Not mounted  [HDR_2x10-NC]
P5  HW4-2.0  Assembly: Not mounted  [TAIFENG_HW4-2.0-NC]
P6  HW4-2.0  Assembly: Not mounted  [TAIFENG_HW4-2.0-NC]
P7  HW4-2.0  Assembly: Not mounted  [TAIFENG_HW4-2.0-NC]
P8  HW4-2.0  Assembly: Not mounted  [TAIFENG_HW4-2.0-NC]
P9  Pin Header 2x5  [HDR_2x5-SMD-1.27mm-ANG]
Q6  DMN3190LDW  [SOT-363]  (parts A,B of 2)
Q7  DMN3190LDW  [SOT-363]  (parts A,B of 2)
R22  4k7  [RESC1005X04L]
R23  4k7  [RESC1005X04L]
R24  4k7  [RESC1005X04L]
R25  4k7  [RESC1005X04L]
SW2  PB SW  [Switch-PB-6.2x6.3mm-SMD]
TP19  Ø1.5mm,SMD  [TP_SMD_Ø1.5mm]  (value not drawn)  (no BOM)
TP20  Ø1.5mm,SMD  [TP_SMD_Ø1.5mm]  (value not drawn)  (no BOM)
TP24  Ø1.5mm,SMD  [TP_SMD_Ø1.0mm]  (value not drawn)  (no BOM)
TP25  Ø1.5mm,SMD  [TP_SMD_Ø1.0mm]  (value not drawn)  (no BOM)

### Blocks framed on the sheet
Interface connectors: P4-P8
Programming / debugging interface: P9 TP19 TP20
N-MOS transistors: Q6 Q7
NFC antenna connector: C45 C46 J3 TP24 TP25
Button: SW2
I2C Pull resistors: R22-R25

### Ports
ANA/DIG0 (bidir), ANA/DIG1 (bidir), ANA/DIG2 (bidir), BUTTON (bidir), IOEXT0 (bidir), IOEXT1 (bidir), IOEXT2 (bidir), IOEXT3 (bidir), MOS_1 (bidir), MOS_2 (bidir), MOS_3 (bidir), MOS_4 (bidir), NFC1 (bidir), NFC2 (bidir), SCL (bidir), SCL_EXT (bidir), SDA (bidir), SDA_EXT (bidir), SWDCLK (bidir), SWDIO (bidir)

### Nets
GND: C45.2 C46.1 P4.6 P4.20 P5.4 P6.4 P7.4 P8.4 P9.3 P9.5 P9.9 SW2.1(N.O)
VDD: P4.19 P6.3 P8.3 R22.1 R23.1
VREG: P5.3 P7.3 P9.1 R24.1 R25.1
IOEXT0: P4.7 ; port IOEXT0
IOEXT1: P4.8 ; port IOEXT1
IOEXT2: P4.9 ; port IOEXT2
IOEXT3: P4.10 ; port IOEXT3
MOS_1_D: P4.11 Q6.6(D1)
MOS_1_S: P4.12 Q6.1(S1)
MOS_2_D: P4.13 Q6.3(D2)
MOS_2_S: P4.14 Q6.4(S2)
MOS_3_D: P4.15 Q7.6(D1)
MOS_3_S: P4.16 Q7.1(S1)
MOS_4_D: P4.17 Q7.3(D2)
MOS_4_S: P4.18 Q7.4(S2)
P0.02: P4.3 P6.1 ; port ANA/DIG0
P0.03: P4.4 P6.2 ; port ANA/DIG1
P0.04: P4.5 P8.1 ; port ANA/DIG2
P0.07: R22.2 ; port SDA
P0.08: R23.2 ; port SCL
P0.09: C45.1 J3.2 TP24.1 ; port NFC1
P0.10: C46.2 J3.4 TP25.1 ; port NFC2
P0.11: SW2.2(COM) ; port BUTTON
P0.14: P4.2 P5.2 P7.2 R24.2 ; port SDA_EXT
P0.15: P4.1 P5.1 P7.1 R25.2 ; port SCL_EXT
P0.18: Q6.2(G1) ; port MOS_1
P0.19: Q6.5(G2) ; port MOS_2
P0.20: Q7.2(G1) ; port MOS_3
P0.21: Q7.5(G2) ; port MOS_4
SWDCLK: P9.4 TP20.1 ; port SWDCLK
SWDIO: P9.2 TP19.1 ; port SWDIO

Not connected (* = marked no-connect by the designer): J3 1 3 5; P8 2; P9 6 7 8 10

### Notes on the sheet
- Title
- Size
- Date:
- Project Number
- Sheet         of
- Revision
- File:
- Drawn By:
- (in symbol Hole_3MM_NP) N.P.

### Library data of the parts
C45 C46 = C0402-270p: Capacitor, NP0, ±5%; Part number IPS: 00000007973; Note: 50V; Artikkelnr Noca: 20029240; Artikkelnr Simpro: N.A.; Part Number: C0402-270p; Manufacturer: *; Manufacturer Part Number: *; Datasheet: *; Footprint Doc: 0402; LatestRevisionDate: 2009-05-08; Pin Count: 2; Publisher: Nordic Semiconductor; Published: 2009-05-08; Value: 270pF; Supplier: *; Supplier part number: *; 2nd source Supplier: *; 2nd source part number: *
H1-H3 = Hole_3MM_NP: Regular Non-Plated, 3mm hole; Manufacturer: Nordic Semiconductor; Artikkelnr Noca: N.A.; Part Number: Hole_3MM_NP; Manufacturer Part Number: *; Datasheet: *; Footprint Doc: Hole_3MM_NP; LatestRevisionDate: 2009-12-12; Pin Count: 1; Publisher: Nordic Semiconductor; Published: 2009-12-12; Value: 3mm,N.P; Note: Regular Non-Plated, 3mm hole; Supplier: *; Supplier part number: *; 2nd source Supplier: *; 2nd source part number: *; Artikkelnr Simpro: N.A.
J3 = FPC_05P-0.5mm-RA-SMD: 0.5mm FPC, 5P,Right Angle SMT,Double Contact,H=1.2mm,White, Tin plated; Manufacturer: W-CON; Manufacturer Part Number: 5141-05RZDNWR01; 2nd source part number: WM9836CT-ND; Part number IPS: 00000007792; Artikkelnr Noca: 55010020; Artikkelnr Simpro: N.A.; Part Number: FPC_05P-0.5mm-RA-SMD; Datasheet: \\hizz\pro\app9717\Datasheet\connectores\W-CON\5141-XXRZDNXX0X.pdf; Footprint Doc: FPC_05P-0.5mm-RA-SMD; LatestRevisionDate: 2016-04-21; Pin Count: 7; Publisher: Nordic Semiconductor; Published: 2015-06-22; Value: FPC 0.5mm RA SMD; Note: *; Supplier: Cabcon; Supplier part number: 5141-05RZDNWR01; 2nd source Supplier: Digi-Key
P4 = Pin Header 2x10, N.C.: Pin Header 2x10, 2.54mm (100mil); Artikkelnr Noca: N.A.; Part Number: Pin Header 2x10, N.C.; Manufacturer: *; Manufacturer Part Number: *; Datasheet: *; Footprint Doc: HDR_2x10; LatestRevisionDate: 2017-02-02; Pin Count: 20; Publisher: Nordic Semiconductor; Published: 2017-01-30; Value: Pin Header 2x10; Note: *; Supplier: *; Supplier part number: *; 2nd source Supplier: *; 2nd source part number: *; Artikkelnr Simpro: N.A.
P5-P8 = Taifeng_HW4-2.0, N.C.: 4 pin, Grove DIP connector; Artikkelnr Noca: N.A.; Part Number: Taifeng_HW4-2.0, N.C.; Manufacturer: Taifeng; Manufacturer Part Number: HW4-2.0; Datasheet: *; Footprint Doc: HW4-2.0; LatestRevisionDate: 2017-01-30; Pin Count: 4; Publisher: Nordic Semiconductor; Published: 2017-01-30; Value: HW4-2.0; Note: *; Supplier: Seeedstudio; Supplier part number: 110990030; 2nd source Supplier: *; 2nd source part number: *; Artikkelnr Simpro: N.A.
P9 = Pin Header 2x5 SMD, 1.27mm, Angled: Pin Header 2x5, 1.27mm (50mil); Manufacturer: Samtec; Manufacturer Part Number: FTSH-105-01-L-DH-A-C-TR; Part number IPS: 00000007800; Artikkelnr Noca: N.A.; Part Number: Pin Header 2x5 SMD, 1.27mm, Angled; Datasheet: http://www.samtec.com/documents/webfiles/pdf/FTSH_SMT.PDF; LatestRevisionDate: 2014-01-22; Pin Count: 10; Publisher: Nordic Semiconductor; Published: 2014-01-22; Value: Pin Header 2x5; Note: *; Supplier: Samtec; Supplier part number: FTSH-105-01-L-DH-A-C-TR; 2nd source Supplier: *; 2nd source part number: *; Footprint Doc: HDR_2x5-SMD-1.27mm-ANG; Artikkelnr Simpro: N.A.
Q6 Q7 = DMN3190LDW: Dual N Ch MOFET, 1A, 190mOhm, 320mW; Manufacturer: Diodes Incorporated; Part number IPS: 00000007804; Note: Dual N Channel Digital FET; Artikkelnr Noca: N.A.; Part Number: DMN3190LDW; Manufacturer Part Number: DMN3190LDW; Datasheet: http://www.diodes.com/_files/datasheets/DMN3190LDW.pdf; Footprint Doc: SOT-363; LatestRevisionDate: 2016-09-22; Pin Count: 6; Publisher: Nordic Semiconductor; Published: 2016-09-22; Value: DMN3190LDW; Supplier: Digi-Key; Supplier part number: DMN3190LDW-13DICT-ND; 2nd source Supplier: *; 2nd source part number: *; Artikkelnr Simpro: N.A.
R22-R25 = R0402-4k7: Resistor, ±1%, 0.063W; Part number IPS: 00000003433; Note: Chip Res 1%; Artikkelnr Noca: 27049089; Artikkelnr Simpro: N.A.; Value Ohm: 4700; Part Number: R0402-4k7; Manufacturer: *; Manufacturer Part Number: *; Datasheet: *; Footprint Doc: 0402; LatestRevisionDate: 2009-11-23; Pin Count: 2; Publisher: Nordic Semiconductor; Published: 2009-05-08; Value: 4k7; Supplier: Farnell; Supplier part number: 173-8858; 2nd source Supplier: *; 2nd source part number: *
SW2 = Switch-PB-6.2x6.3mm-SMD: Tactile Switch, SPNO, SMD, 160gf, 6.2x6.3x2.5mm; Manufacturer: Dailywell; Manufacturer Part Number: TS604VM1-025BR-R; 2nd source part number: 688-SKHUALE010; Part number IPS: 00000007812; Artikkelnr Noca: 50019106; Artikkelnr Simpro: N.A.; Part Number: Switch-PB-6.2x6.3mm-SMD; Datasheet: \\hizz\pro\app9717\Datasheet\switches\Dailywell\TS604VM1-025BR-R.pdf; Footprint Doc: Switch-PB-6.2x6.3mm-SMD; LatestRevisionDate: 2016-04-21; Pin Count: 4; Publisher: Nordic Semiconductor; Published: 2010-02-01; Value: PB SW; Note: *; Supplier: Cabcon; Supplier part number: TS604VM1-025BR-R; 2nd source Supplier: Mouser
TP19 TP20 TP24 TP25 = TP_SMD_Ø1.5MM: as TP13 on sheet pca20020_sheet7_sound_and_light; Part Number: TP_SMD_Ø1.5MM; Manufacturer Part Number: *; Datasheet: *; Footprint Doc: TP_SMD_Ø1.5mm; LatestRevisionDate: 2016-06-02; Pin Count: 1; Publisher: Nordic Semiconductor; Published: 2016-06-02; Value: Ø1.5mm,SMD; Note: *; Supplier: *; Supplier part number: *; 2nd source Supplier: *; 2nd source part number: *; Artikkelnr Simpro: N.A.

## Nets that join several sheets
GND: pca20020_sheet2_mcu (20 pins), pca20020_sheet3_io_expander (8 pins), pca20020_sheet5_motion_sensors (16 pins), pca20020_sheet6_environment_sensors (18 pins), pca20020_sheet7_sound_and_light (18 pins), pca20020_sheet8_power_supply (29 pins), pca20020_sheet9_interface (12 pins)
VDD: pca20020_sheet3_io_expander (7 pins), pca20020_sheet5_motion_sensors (C18.2 U4.14 U4.15), pca20020_sheet6_environment_sensors (13 pins), pca20020_sheet7_sound_and_light (10 pins), pca20020_sheet8_power_supply (TP11.1 U15.1), pca20020_sheet9_interface (5 pins)
VDD_nRF: pca20020_sheet2_mcu (6 pins), pca20020_sheet8_power_supply (P2.2 SB2.1)
VLi-Ion: pca20020_sheet7_sound_and_light (U13.5), pca20020_sheet8_power_supply (10 pins)
VREG: pca20020_sheet5_motion_sensors (7 pins), pca20020_sheet8_power_supply (8 pins), pca20020_sheet9_interface (5 pins)
BAT_MON_EN: pca20020_sheet3_io_expander (U2.5), pca20020_sheet8_power_supply (Q1.2 R2.1)
CCS_PWR_CTRL: pca20020_sheet3_io_expander (U2.15), pca20020_sheet6_environment_sensors (U10.2)
CCS_RESET: pca20020_sheet3_io_expander (U2.16), pca20020_sheet6_environment_sensors (U9.2)
CCS_WAKE: pca20020_sheet3_io_expander (U2.19), pca20020_sheet6_environment_sensors (U9.7)
IOEXT0: pca20020_sheet3_io_expander (U2.27), pca20020_sheet9_interface (P4.7)
IOEXT1: pca20020_sheet3_io_expander (U2.28), pca20020_sheet9_interface (P4.8)
IOEXT2: pca20020_sheet3_io_expander (U2.1), pca20020_sheet9_interface (P4.9)
IOEXT3: pca20020_sheet3_io_expander (U2.2), pca20020_sheet9_interface (P4.10)
LIGHTWELL_B: pca20020_sheet3_io_expander (U2.7), pca20020_sheet7_sound_and_light (Q2.5 R31.2)
LIGHTWELL_G: pca20020_sheet3_io_expander (U2.6), pca20020_sheet7_sound_and_light (Q3.2 R30.2)
LIGHTWELL_R: pca20020_sheet3_io_expander (U2.8), pca20020_sheet7_sound_and_light (Q2.2 R29.2)
LIS_INT1: pca20020_sheet4_pin_map (SB9.1), pca20020_sheet5_motion_sensors (U5.12)
LIS_INT2: pca20020_sheet4_pin_map (SB10.1), pca20020_sheet5_motion_sensors (U5.11)
MIC_PWR_CTRL: pca20020_sheet3_io_expander (U2.14), pca20020_sheet7_sound_and_light (U12.2)
MPU_PWR_CTRL: pca20020_sheet3_io_expander (U2.13), pca20020_sheet5_motion_sensors (U4.2)
P0.02: pca20020_sheet2_mcu (U1.4), pca20020_sheet9_interface (P4.3 P6.1)
P0.03: pca20020_sheet2_mcu (U1.5), pca20020_sheet9_interface (P4.4 P6.2)
P0.04: pca20020_sheet2_mcu (U1.6), pca20020_sheet9_interface (P4.5 P8.1)
P0.05: pca20020_sheet2_mcu (U1.7), pca20020_sheet3_io_expander (U2.11)
P0.06: pca20020_sheet2_mcu (U1.8), pca20020_sheet5_motion_sensors (U4.4)
P0.07: pca20020_sheet2_mcu (U1.9), pca20020_sheet3_io_expander (U2.24), pca20020_sheet4_pin_map (TP17.1), pca20020_sheet5_motion_sensors (U4.7), pca20020_sheet6_environment_sensors (U6.4 U7.4 U8.6 U10.11), pca20020_sheet9_interface (R22.2)
P0.08: pca20020_sheet2_mcu (U1.10), pca20020_sheet3_io_expander (U2.25), pca20020_sheet4_pin_map (TP18.1), pca20020_sheet5_motion_sensors (U4.11), pca20020_sheet6_environment_sensors (U6.2 U7.2 U8.5 U10.7), pca20020_sheet9_interface (R23.2)
P0.09: pca20020_sheet2_mcu (U1.11), pca20020_sheet9_interface (C45.1 J3.2 TP24.1)
P0.10: pca20020_sheet2_mcu (U1.12), pca20020_sheet9_interface (C46.2 J3.4 TP25.1)
P0.11: pca20020_sheet2_mcu (U1.14), pca20020_sheet9_interface (SW2.2)
P0.12: pca20020_sheet2_mcu (U1.15), pca20020_sheet4_pin_map (SB9.2 SB10.2)
P0.13: pca20020_sheet2_mcu (U1.16), pca20020_sheet8_power_supply (R13.2 R14.1)
P0.14: pca20020_sheet2_mcu (U1.17), pca20020_sheet5_motion_sensors (U5.4), pca20020_sheet9_interface (P4.2 P5.2 P7.2 R24.2)
P0.15: pca20020_sheet2_mcu (U1.18), pca20020_sheet5_motion_sensors (U5.1), pca20020_sheet9_interface (P4.1 P5.1 P7.1 R25.2)
P0.16: pca20020_sheet2_mcu (U1.19), pca20020_sheet3_io_expander (R1.1 U2.23)
P0.17: pca20020_sheet2_mcu (U1.20), pca20020_sheet8_power_supply (R15.2 R16.1 U16.3)
P0.18: pca20020_sheet2_mcu (U1.21), pca20020_sheet9_interface (Q6.2)
P0.19: pca20020_sheet2_mcu (U1.22), pca20020_sheet9_interface (Q6.5)
P0.20: pca20020_sheet2_mcu (U1.23), pca20020_sheet9_interface (Q7.2)
P0.21: pca20020_sheet2_mcu (U1.24), pca20020_sheet9_interface (Q7.5)
P0.22: pca20020_sheet2_mcu (U1.27), pca20020_sheet6_environment_sensors (U10.4)
P0.23: pca20020_sheet2_mcu (U1.28), pca20020_sheet6_environment_sensors (U6.7)
P0.24: pca20020_sheet2_mcu (U1.29), pca20020_sheet6_environment_sensors (U7.3)
P0.25: pca20020_sheet2_mcu (C33.2 U1.37), pca20020_sheet7_sound_and_light (U12.12)
P0.26: pca20020_sheet2_mcu (C32.2 U1.38), pca20020_sheet7_sound_and_light (U12.8)
P0.27: pca20020_sheet2_mcu (U1.39), pca20020_sheet7_sound_and_light (D1.1 Q4.2 SB7.2 TP21.1)
P0.28: pca20020_sheet2_mcu (U1.40), pca20020_sheet8_power_supply (R20.2 R21.1)
P0.29: pca20020_sheet2_mcu (U1.41), pca20020_sheet7_sound_and_light (U13.3)
P0.30: pca20020_sheet2_mcu (U1.42), pca20020_sheet8_power_supply (U15.3)
P0.31: pca20020_sheet2_mcu (U1.43), pca20020_sheet6_environment_sensors (U8.7)
SENSE_LED_B: pca20020_sheet3_io_expander (U2.22), pca20020_sheet7_sound_and_light (R12.1)
SENSE_LED_G: pca20020_sheet3_io_expander (U2.21), pca20020_sheet7_sound_and_light (R11.1)
SENSE_LED_R: pca20020_sheet3_io_expander (U2.20), pca20020_sheet7_sound_and_light (R10.1)
SWDCLK: pca20020_sheet2_mcu (U1.25), pca20020_sheet9_interface (P9.4 TP20.1)
SWDIO: pca20020_sheet2_mcu (U1.26), pca20020_sheet9_interface (P9.2 TP19.1)